# Altium schematic sheet pca63100_misc.SchDoc: Power Profiler Kit II
size A3; Organization: Nordic Semiconductor; Revision: 1.0.1; SheetNumber: 6; SheetTotal: 6; CompanyName: Nordic Semiconductor; DocumentSize: A3
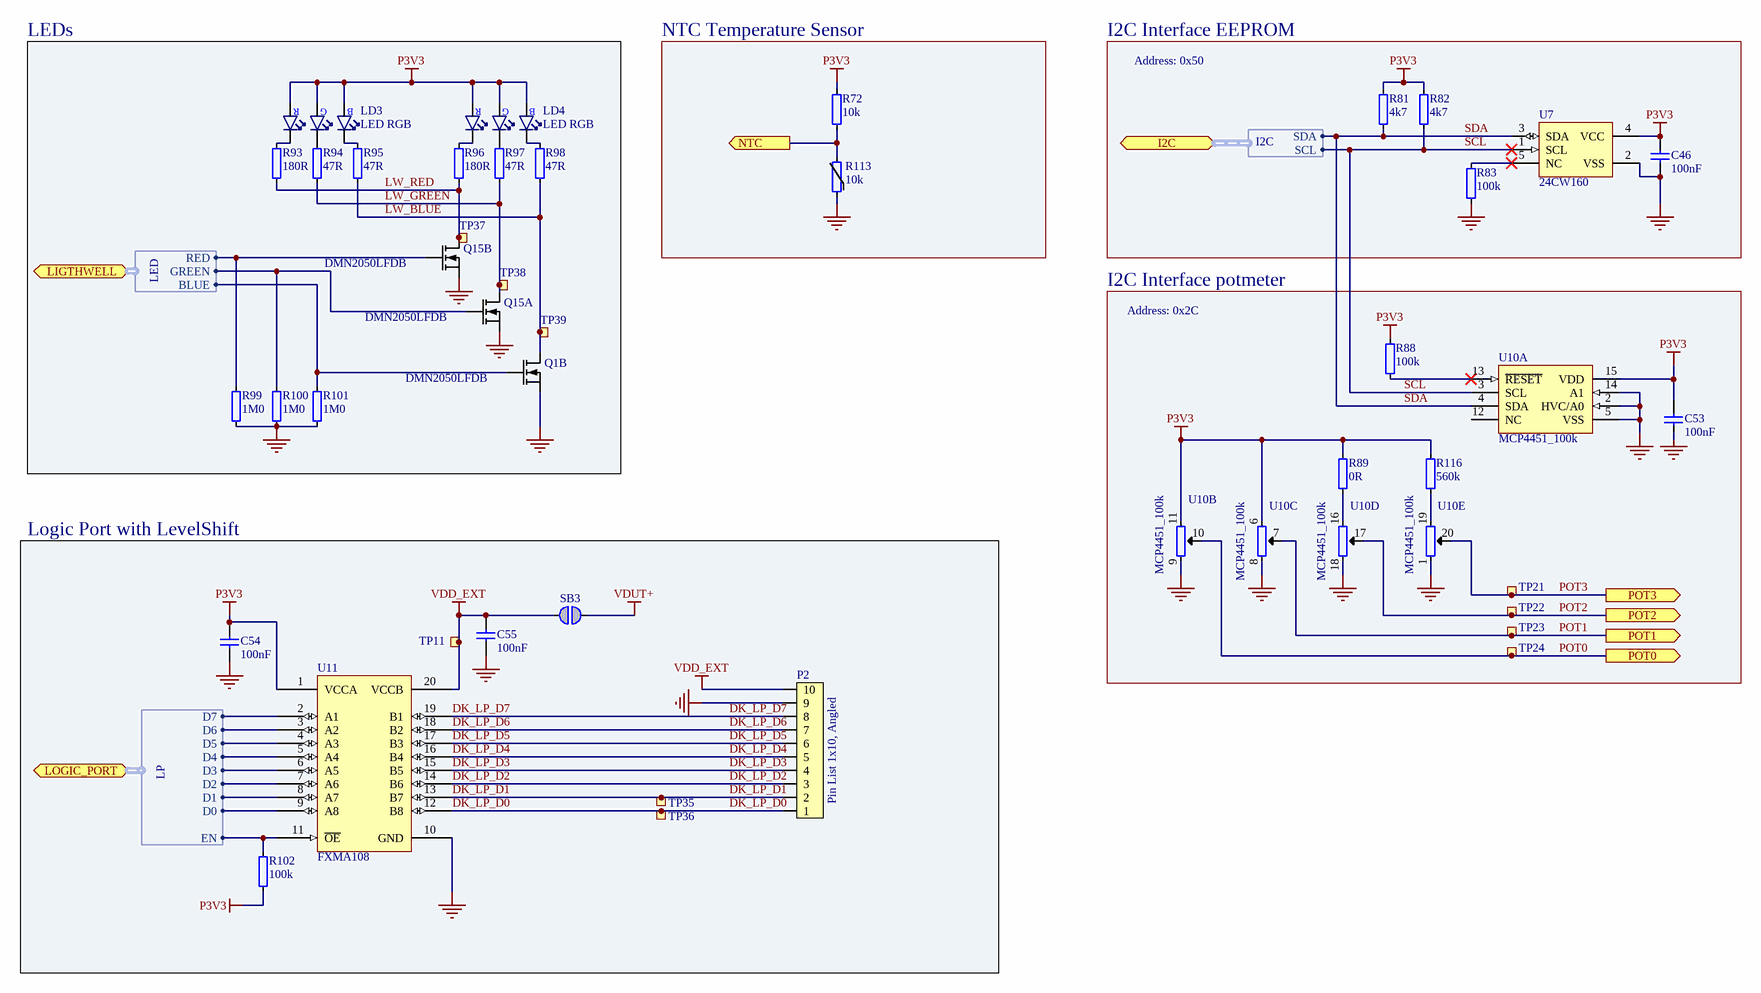
[diagram p0: pca63100_misc.SchDoc]

## Parts
C46  100nF  [CAPC0603X03L_C]
C53  100nF  [CAPC0603X03L_C]
C54  100nF  [CAPC0603X03L_C]
C55  100nF  [CAPC0603X03L_C]
LD3  LED RGB  [MSL0104]
LD4  LED RGB  [MSL0104]
P2  Pin List 1x10, Angled  [LIST_ANG_1x10-SMD-2.54MM]
Q1  DMN2050LFDB  [DFN65P200X60_HS-6N]  (part B of 2)
Q15  DMN2050LFDB  [DFN65P200X60_HS-6N]  (parts A,B of 2)
R72  10k  [RESC0603X03L_C]
R81  4k7  [RESC0603X03L_C]
R82  4k7  [RESC0603X03L_C]
R83  100k  [RESC0603X03L_C]
R88  100k  [RESC0603X03L_C]
R89  0R  [RESC0603X03L_C]
R93  180R  [RESC0603X03L_C]
R94  47R  [RESC0603X03L_C]
R95  47R  [RESC0603X03L_C]
R96  180R  [RESC0603X03L_C]
R97  47R  [RESC0603X03L_C]
R98  47R  [RESC0603X03L_C]
R99  1M0  [RESC0603X03L_C]
R100  1M0  [RESC0603X03L_C]
R101  1M0  [RESC0603X03L_C]
R102  100k  [RESC0603X03L_C]
R113  10k  [RESC1005X04L]
R116  560k  [RESC0603X03L_C]
SB3  Solderbridge  [Solderbridge]  (value not drawn)  (no BOM)
TP11  Ø1.5mm,SMD  [TP_SMD_Ø1.5mm]  (value not drawn)  (no BOM)
TP21  Ø0.7mm,SMD  [TP_SMD_Ø0.7mm]  (value not drawn)  (no BOM)
TP22  Ø0.7mm,SMD  [TP_SMD_Ø0.7mm]  (value not drawn)  (no BOM)
TP23  Ø0.7mm,SMD  [TP_SMD_Ø0.7mm]  (value not drawn)  (no BOM)
TP24  Ø0.7mm,SMD  [TP_SMD_Ø0.7mm]  (value not drawn)  (no BOM)
TP35  Ø1.5mm,SMD  [TP_SMD_Ø1.5mm]  (value not drawn)  (no BOM)
TP36  Ø1.5mm,SMD  [TP_SMD_Ø1.5mm]  (value not drawn)  (no BOM)
TP37  Ø0.7mm,SMD  [TP_SMD_Ø0.7mm]  (value not drawn)  (no BOM)
TP38  Ø0.7mm,SMD  [TP_SMD_Ø0.7mm]  (value not drawn)  (no BOM)
TP39  Ø0.7mm,SMD  [TP_SMD_Ø0.7mm]  (value not drawn)  (no BOM)
U7  24CW160  [SOT-23-5]
U10  MCP4451_100k  [QFN50P400X400X80_HS-21N]  (parts A,B,C,D,E of 5)
U11  FXMA108  [QFN50P450X250X80_HS-21N]

## Blocks framed on the sheet
LEDs: LD3 LD4 Q1 Q15 R93-R101 TP37-TP39
NTC Temperature Sensor: R72 R113
I2C Interface EEPROM: C46 R81-R83 U7
I2C Interface potmeter: C53 R88 R89 R116 TP21-TP24 U10
Logic Port with LevelShift: C54 C55 P2 R102 SB3 TP11 TP35 TP36 U11

## Ports
I2C (bidir, harness I2C), LIGTHWELL (bidir, harness LED), LOGIC_PORT (bidir, harness LP), NTC (out), POT0 (out), POT1 (out), POT2 (out), POT3 (out)

## Harnesses
LED: BLUE, GREEN, RED
LP: D0, EN, D1, D2, D3, D4, D5, D6, D7
I2C: SCL, SDA

## Nets
GND: C46.2 C53.1 C54.2 C55.2 P2.9 Q1.4(S2) Q15.1(S1) Q15.4(S2) R83.1 R99.1 R100.1 R101.1 R113.1 U7.2(VSS) U10.1(P3B) U10.2(HVC/A0) U10.5(VSS) U10.8(P1A) U10.9(P0A) U10.14(A1) U10.18(P2A) U10.21(VSS) U11.10(GND)
P3V3: C46.1 C53.2 C54.1 LD3.1(A_RED) LD3.2(A_GREEN) LD3.6(A_BLUE) LD4.1(A_RED) LD4.2(A_GREEN) LD4.6(A_BLUE) R72.2 R81.2 R82.2 R88.2 R89.2 R102.2 R116.2 U7.4(VCC) U10.6(P1B) U10.11(P0B) U10.15(VDD) U11.1(VCCA)
VDD_EXT: C55.1 P2.10 SB3.2 TP11.1 U11.20(VCCB)
VDUT+: SB3.1
DK_LP_D0: P2.1 TP36.1 U11.12(B8)
DK_LP_D1: P2.2 TP35.1 U11.13(B7)
DK_LP_D2: P2.3 U11.14(B6)
DK_LP_D3: P2.4 U11.15(B5)
DK_LP_D4: P2.5 U11.16(B4)
DK_LP_D5: P2.6 U11.17(B3)
DK_LP_D6: P2.7 U11.18(B2)
DK_LP_D7: P2.8 U11.19(B1)
LW_BLUE: Q1.3(D2) R95.1 R98.1 TP39.1
LW_GREEN: Q15.6(D1) R94.1 R97.1 TP38.1
LW_RED: Q15.3(D2) R93.1 R96.1 TP37.1
NTC: R72.1 R113.2 ; port NTC
POT0: TP24.1 U10.10(P0W) ; port POT0
POT1: TP23.1 U10.7(P1W) ; port POT1
POT2: TP22.1 U10.17(P2W) ; port POT2
POT3: TP21.1 U10.20(P3W) ; port POT3
SCL: R82.1 U7.1(SCL) U10.3(SCL) ; port I2C.SCL
SDA: R81.1 U7.3(SDA) U10.4(SDA) ; port I2C.SDA
NetLD3_3: LD3.3(C_GREEN) R94.2
NetLD3_4: LD3.4(C_RED) R93.2
NetLD3_5: LD3.5(C_BLUE) R95.2
NetLD4_3: LD4.3(C_GREEN) R97.2
NetLD4_4: LD4.4(C_RED) R96.2
NetLD4_5: LD4.5(C_BLUE) R98.2
NetQ1_5: Q1.5(G2) R101.2 ; port LIGTHWELL.BLUE
NetQ15_2: Q15.2(G1) R100.2 ; port LIGTHWELL.GREEN
NetQ15_5: Q15.5(G2) R99.2 ; port LIGTHWELL.RED
NetR83_2: R83.2 U7.5(NC)
NetR88_1: R88.1 U10.13(~{RESET})
NetR89_1: R89.1 U10.16(P2B)
NetR102_1: R102.1 U11.11(~{OE}) ; port LOGIC_PORT.EN
NetR116_1: R116.1 U10.19(P3A)
NetU11_2: U11.2(A1) ; port LOGIC_PORT.D7
NetU11_3: U11.3(A2) ; port LOGIC_PORT.D6
NetU11_4: U11.4(A3) ; port LOGIC_PORT.D5
NetU11_5: U11.5(A4) ; port LOGIC_PORT.D4
NetU11_6: U11.6(A5) ; port LOGIC_PORT.D3
NetU11_7: U11.7(A6) ; port LOGIC_PORT.D2
NetU11_8: U11.8(A7) ; port LOGIC_PORT.D1
NetU11_9: U11.9(A8) ; port LOGIC_PORT.D0

Not connected (* = marked no-connect by the designer): U10 12(NC)

## Notes on the sheet
- Address: 0x50
- Address: 0x2C
- Size
- Date:
- A3
- Project Number
- Sheet         of
- Revision
- File:
- Drawn By:
- (in symbol MSL0104RGBU1) R; G; B

## Library data of the parts
C46 C53-C55 = C0201-100n: Capacitor, X5R, ±10%; Part number IPS: 00000001248, 00000002505; Note: 16V; Artikkelnr Noca: N.A.; Pad Count: 2; Part Number: C0201-100n; LatestRevisionDate: 2017-11-09; Pin Count: 2; Publisher: Nordic Semiconductor; Published: 2014-11-13; Value: 100nF; Footprint Doc: 0201; ComponentLink1Description: Datasheet; ComponentLink2Description: Supplier link; Component Class: Capacitors; PartId: 100200078
LD3 LD4 = MSL0104RGBU1: High brightness, side view RGB LED; Manufacturer: ROHM; Part number IPS: 00000007799; Artikkelnr Noca: N.A.; Pad Count: 7; Part Number: MSL0104RGBU1; Manufacturer Part Number: MSL0104RGBU1; LatestRevisionDate: 2016-09-21; Pin Count: 7; Publisher: Nordic Semiconductor; Published: 2016-09-21; Value: LED RGB; Footprint Doc: 6922; Supplier 1: Digi-Key; Supplier Part Number 1: MSL0104RGBU1CT-ND; Supplier 2: Mouser; Supplier Part Number 2: 755-MSL0104RGBU1; ComponentLink1Description: Datasheet; ComponentLink2Description: Supplier link; HelpURL: http://www.rohm.com/web/eu/datasheet/MSL0104RGBU; Component Class: Optoelectronics; PartId: 101400028
P2 = Pin List Ang 1x10 SMD, 2.54mm: Pin List 1x10, 2.54mm (100mil), Right Angled, SMD; Part number IPS: 00000004781; Artikkelnr Noca: N.A.; Pad Count: 10; Part Number: Pin List Ang 1x10 SMD, 2.54mm; LatestRevisionDate: 2020-04-29; Pin Count: 10; Publisher: Nordic Semiconductor; Published: 2015-01-23; Value: Pin List 1x10, Angled; Footprint Doc: LIST_ANG_1x10-SMD-2.54MM; ComponentLink1Description: Datasheet; ComponentLink2Description: Supplier link; Supplier 1: Cabcon; Supplier Part Number 1: 1125B-1110S0Z135CR02; Supplier 2: Samtec; Supplier Part Number 2: TSM-110-01-L-SH-A; Component Class: Connectors; PartId: 100500371
Q1 Q15 = DMN2050LFDB: Dual N Ch MOFET, 3.3A, 45mOhm @ 5A, 4.5V, 730mW; Manufacturer: Diodes Incorporated; Manufacturer Part Number: DMN2050LFDB-7; Part number IPS: 00000004782; Artikkelnr Noca: N.A.; Pad Count: 6; Part Number: DMN2050LFDB; Footprint Doc: DFN-6; LatestRevisionDate: 2020-04-30; Pin Count: 6; Publisher: Nordic Semiconductor; Published: 2020-04-30; Value: DMN2050LFDB; Supplier 1: Digi-Key; Supplier Part Number 1: DMN2050LFDB-7DICT-ND; Supplier 2: Mouser; Supplier Part Number 2: 621-DMN2050LFDB-7; ComponentLink1URL: https://www.diodes.com/assets/Datasheets/DMN2050LFDB.pdf; ComponentLink1Description: Datasheet; ComponentLink2Description: Supplier link; HelpURL: https://www.diodes.com/assets/Datasheets/DMN2050LFDB.pdf; Component Class: Semiconductors; PartId: 101300176
R72 = R0201-10k_0.1%: Resistor, ±0.1%, 0.031W; Part number IPS: 00000004786; Note: Chip Res 0.1%; Artikkelnr Noca: N.A.; Pad Count: 2; Part Number: R0201-10k_0.1%; Footprint Doc: 0201; LatestRevisionDate: 2019-10-07; Pin Count: 2; Publisher: Nordic Semiconductor; Published: 2019-10-07; Value: 10k; ComponentLink1Description: Datasheet; ComponentLink2Description: Supplier link; Component Class: Resistors; PartId: 100100597
R81 R82 = R0201-4k7: Resistor, ±1%, 0.05W; Part number IPS: 00000001706; Note: Chip Res 1%; Artikkelnr Noca: N.A.; Pad Count: 2; Part Number: R0201-4k7; Footprint Doc: 0201; LatestRevisionDate: 2014-11-13; Pin Count: 2; Publisher: Nordic Semiconductor; Published: 2014-11-13; Value: 4k7; ComponentLink1Description: Datasheet; ComponentLink2Description: Supplier link; Component Class: Resistors; PartId: 100100061
R83 R88 R102 = R0201-100k: Resistor, ±1%, 0.05W; Part number IPS: 00000001419; Note: Chip Res 1%; Artikkelnr Noca: N.A.; Pad Count: 2; Part Number: R0201-100k; Footprint Doc: 0201; LatestRevisionDate: 2014-11-13; Pin Count: 2; Publisher: Nordic Semiconductor; Published: 2014-11-13; Value: 100k; ComponentLink1Description: Datasheet; ComponentLink2Description: Supplier link; Component Class: Resistors; PartId: 100100080
R89 = R0201-0R: Resistor, ±5%, 0.05W; Part number IPS: 00000003245; Note: Chip Res 5%; Artikkelnr Noca: N.A.; Pad Count: 2; Part Number: R0201-0R; Footprint Doc: 0201; LatestRevisionDate: 2017-11-09; Pin Count: 2; Publisher: Nordic Semiconductor; Published: 2014-11-13; Value: 0R; ComponentLink1Description: Datasheet; ComponentLink2Description: Supplier link; Component Class: Resistors; PartId: 100100001
R93 R96 = R0201-180: Resistor, ±1%, 0.05W; Part number IPS: 00000005783; Note: Chip Res 1%; Artikkelnr Noca: N.A.; Pad Count: 2; Part Number: R0201-180; LatestRevisionDate: 2014-11-13; Pin Count: 2; Publisher: Nordic Semiconductor; Published: 2014-11-13; Value: 180R; Footprint Doc: 0201; ComponentLink1Description: Datasheet; ComponentLink2Description: Supplier link; Component Class: Resistors; PartId: 100100030
R94 R95 R97 R98 = R0201-47R: Resistor, ±1%, 0.05W; Part number IPS: 00000004794; Note: Chip Res 1%; Artikkelnr Noca: N.A.; Pad Count: 2; Part Number: R0201-47R; LatestRevisionDate: 2014-11-13; Pin Count: 2; Publisher: Nordic Semiconductor; Published: 2014-11-13; Value: 47R; Footprint Doc: 0201; ComponentLink1Description: Datasheet; ComponentLink2Description: Supplier link; Component Class: Resistors; PartId: 100100022
R99-R101 = R0201-1M0: Resistor, ±1%, 0.05W; Part number IPS: 00000001418; Note: Chip Res 1%; Artikkelnr Noca: N.A.; Pad Count: 2; Part Number: R0201-1M0; LatestRevisionDate: 2014-11-13; Pin Count: 2; Publisher: Nordic Semiconductor; Published: 2014-11-13; Value: 1M0; Footprint Doc: 0201; ComponentLink1Description: Datasheet; ComponentLink2Description: Supplier link; Component Class: Resistors; PartId: 100100093
R113 = NCP15XH103F03RC: THERMISTOR 10K OHM NTC 0402 SMD; Manufacturer: Murata; Part number IPS: 00000007808; Note: Chip Res 1%; Artikkelnr Noca: N.A.; Pad Count: 2; Part Number: NCP15XH103F03RC; Manufacturer Part Number: NCP15XH103F03RC; ComponentLink1Description: Datasheet; ComponentLink2Description: Supplier link; Footprint Doc: 0402; LatestRevisionDate: 2015-03-25; Pin Count: 2; Publisher: Nordic Semiconductor; Published: 2015-03-25; Value: 10k; Supplier 1: Digi-Key; Supplier Part Number 1: 490-4801-1-ND; Supplier 2: Farnell; Supplier Part Number 2: 245-6121; Component Class: Resistors; PartId: 100100507
R116 = R0201-560k: Resistor, ±1%, 0.05W; Part number IPS: 00000004799; Note: Chip Res 1%; Artikkelnr Noca: N.A.; Pad Count: 2; Part Number: R0201-560k; Footprint Doc: 0201; LatestRevisionDate: 2014-11-13; Pin Count: 2; Publisher: Nordic Semiconductor; Published: 2014-11-13; Value: 560k; ComponentLink1Description: Datasheet; ComponentLink2Description: Supplier link; Component Class: Resistors; PartId: 100100090
SB3 = Solderbridge: Artikkelnr Noca: N.A.; Pad Count: 2; Part Number: Solderbridge; ComponentLink1Description: Datasheet; ComponentLink2Description: Supplier link; Footprint Doc: Solderbridge; LatestRevisionDate: 2009-12-14; Pin Count: 2; Publisher: Nordic Semiconductor; Published: 2009-12-14; Value: Solderbridge; Part number IPS: N.A.; Component Class: Connectors; PartId: 100500458
TP11 TP35 TP36 = TP_SMD_Ø1.5MM: 1.5mm circular SMD testpad; Manufacturer: Nordic Semiconductor; Artikkelnr Noca: N.A.; Pad Count: 1; Part Number: TP_SMD_Ø1.5MM; ComponentLink1Description: Datasheet; ComponentLink2Description: Supplier link; Footprint Doc: TP_SMD_Ø1.5mm; LatestRevisionDate: 2016-06-02; Pin Count: 1; Publisher: Nordic Semiconductor; Published: 2016-06-02; Value: Ø1.5mm,SMD; Part number IPS: N.A.; Component Class: Connectors; PartId: 100500477
TP21-TP24 TP37-TP39 = TP_SMD_Ø0.7MM: 0.7mm circular SMD testpad; Manufacturer: Nordic Semiconductor; Artikkelnr Noca: N.A.; Pad Count: 1; Part Number: TP_SMD_Ø0.7MM; ComponentLink1Description: Datasheet; ComponentLink2Description: Supplier link; Footprint Doc: TP_SMD_Ø0.7mm; LatestRevisionDate: 2017-12-14; Pin Count: 1; Publisher: Nordic Semiconductor; Published: 2017-12-14; Value: Ø0.7mm,SMD; Part number IPS: N.A.; Component Class: Connectors; PartId: 100500474
U7 = 24CW160T-I/OT: 16 Kbit I2C Serial EEPROM with Software Write Protection, 1.6-5.5 V Supply; Manufacturer: Microchip; Part number IPS: 00000004049; Artikkelnr Noca: N.A.; Pad Count: 5; Part Number: 24CW160T-I/OT; Manufacturer Part Number: 24CW160T-I/OT; Footprint Doc: TSOT23-5; LatestRevisionDate: 2020-01-17; Pin Count: 5; Publisher: Nordic Semiconductor; Published: 2020-01-17; Value: 24CW160; ComponentLink1URL: http://ww1.microchip.com/downloads/en/DeviceDoc/24CW16X-24CW32X-24CW64X-24CW128X-Data-Sheet-20005772B.pdf; ComponentLink1Description: Datasheet; ComponentLink2URL: https://www.digikey.com/product-detail/en/microchip-technology/24CW160T-I-OT/24CW160T-I-OTCT-ND/8594982; ComponentLink2Description: Supplier link; HelpURL: https://www.microchip.com/wwwproducts/en/24CW160; Supplier 1: Digi-Key; Supplier 2: Mouser; Supplier Part Number 1: 24CW160T-I/OTCT-ND; Supplier Part Number 2: 579-24CW160T-I/OT; Component Class: Misc_ICs; PartId: 101900604
U10 = MCP4451_100k: Quad Digital Potentiometer, 100k, 257 taps, I2C interface, Volatile Memory, 1.8-5.5V; Manufacturer: Microchip Technology; Manufacturer Part Number: MCP4451-104E/ML; Part number IPS: 00000004805; Artikkelnr Noca: 15070064; Pad Count: 20; Part Number: MCP4451_100k; Footprint Doc: QFN-20; LatestRevisionDate: 2016-06-02; Pin Count: 20; Publisher: Nordic Semiconductor; Published: 2016-05-09; Value: MCP4451_100k; ComponentLink1Description: Datasheet; ComponentLink2Description: Supplier link; HelpURL: http://ww1.microchip.com/downloads/en/DeviceDoc/MCP4451.pdf; Supplier 1: Digi-Key; Supplier 2: Mouser; Supplier Part Number 1: MCP4451-104E/ML-ND; Supplier Part Number 2: 579-MCP4451-104E/ML; Component Class: Misc_ICs; PartId: 101900403
U11 = FXMA108BQX: 8-bit bidirectional voltage-level translator with auto-direction sensing; Manufacturer: Fairchild Semiconductor; Part number IPS: 00000004806; Note: Translator, Bidirectional; Artikkelnr Noca: N.A.; Pad Count: 20; Part Number: FXMA108BQX; Manufacturer Part Number: FXMA108BQX; ComponentLink1Description: Datasheet; ComponentLink2Description: Supplier link; HelpURL: http://www.fairchildsemi.com/ds/FX/FXMA108.pdf; Footprint Doc: DQFN-20; LatestRevisionDate: 2014-01-10; Pin Count: 20; Publisher: Nordic Semiconductor; Published: 2014-01-10; Value: FXMA108; Supplier 1: Digi-Key; Supplier Part Number 1: FXMA108BQXFSCT-ND; Supplier 2: Mouser; Supplier Part Number 2: 512-FXMA108BQX; Component Class: Misc_ICs; PartId: 101900233